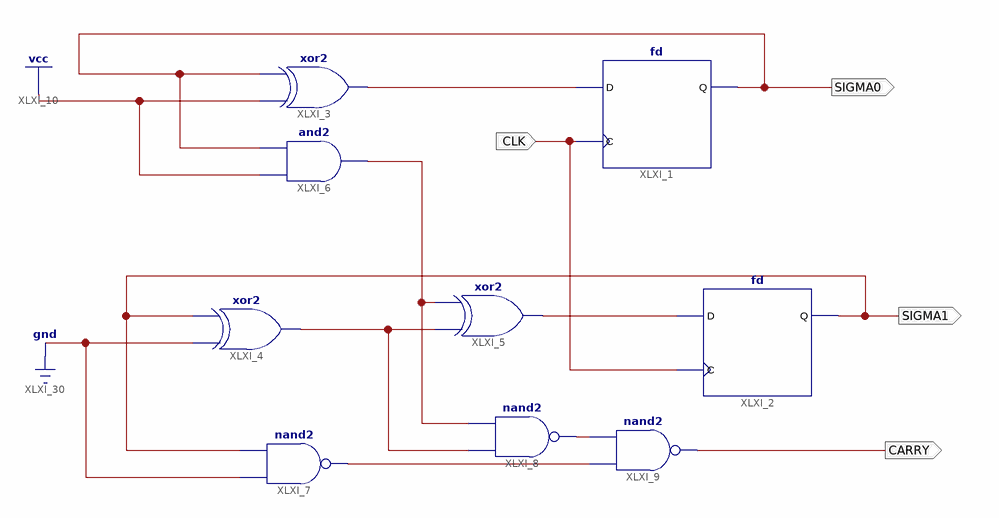
[diagram p0: schematic sheet 1]
// Xilinx ISE schematic CNT2.sch (spartan6) as structural Verilog: 9 symbols, 4 ports
module CNT2 (
  input  CLK,
  output SIGMA0,
  output SIGMA1,
  output CARRY
);

  wire XLXN_1, XLXN_6, XLXN_19, XLXN_21, XLXN_26, XLXN_32;

  fd XLXI_1 (.C(CLK), .D(XLXN_6), .Q(SIGMA0));
  xor XLXI_3 (XLXN_6, 1'b1, SIGMA0);
  and XLXI_6 (XLXN_19, 1'b1, SIGMA0);
  fd XLXI_2 (.C(CLK), .D(XLXN_26), .Q(SIGMA1));
  xor XLXI_4 (XLXN_21, 1'b0, SIGMA1);
  nand XLXI_7 (XLXN_32, 1'b0, SIGMA1);
  xor XLXI_5 (XLXN_26, XLXN_21, XLXN_19);
  nand XLXI_8 (XLXN_1, XLXN_21, XLXN_19);
  nand XLXI_9 (CARRY, XLXN_32, XLXN_1);
endmodule
